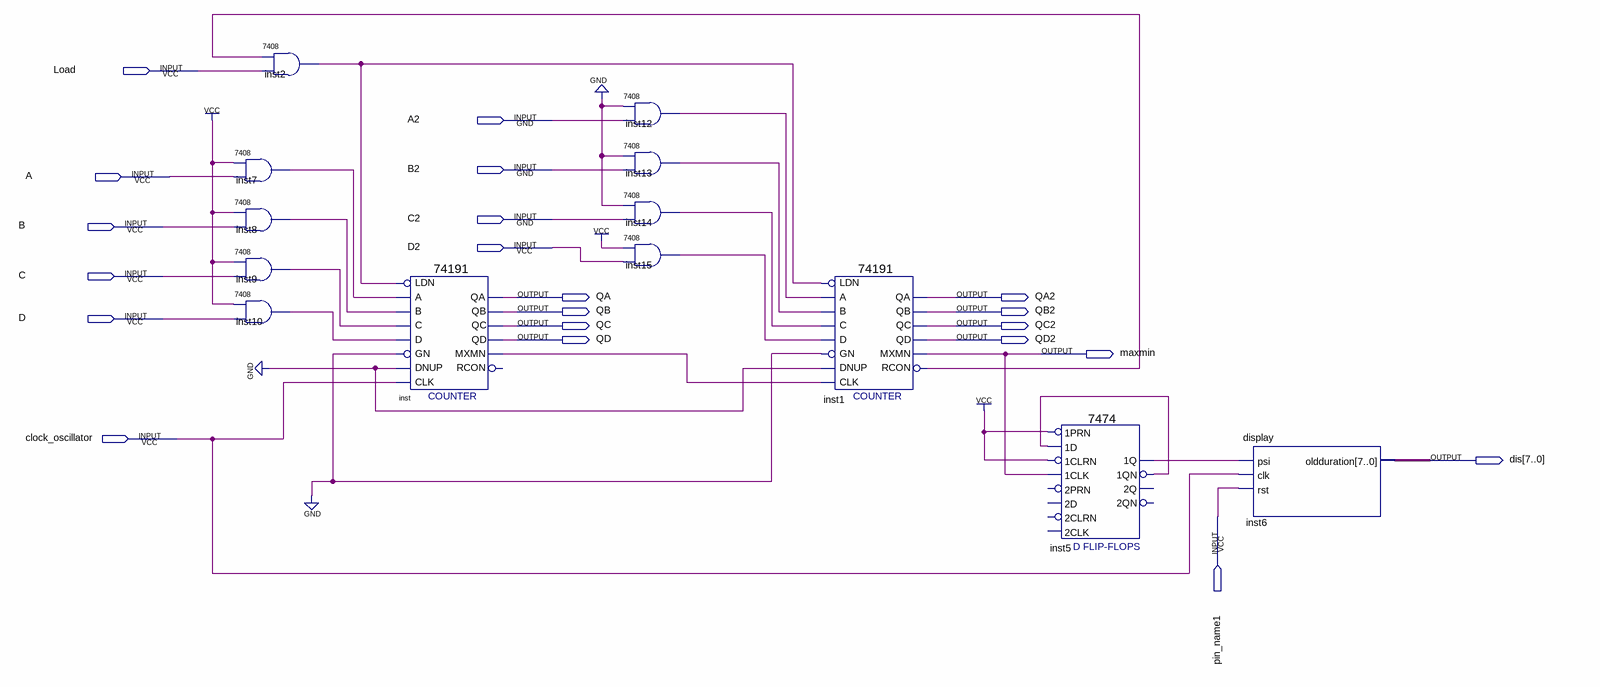
[diagram p0: schematic sheet]
// Quartus schematic F_devider_Q.bdf as structural Verilog: 13 symbols, 21 pins
module F_devider_Q (
  input  Load,
  input  A2,
  input  B2,
  input  A,
  input  C2,
  input  B,
  input  D2,
  input  C,
  input  D,
  input  clock_oscillator,
  input  pin_name1,
  output QA,
  output QA2,
  output QB,
  output QB2,
  output QC,
  output QC2,
  output QD,
  output QD2,
  output maxmin,
  output [7:0] dis
);

  wire inst1_rcon, inst2_1, inst5_1q, inst5_1qn, inst7_1, inst8_1, inst9_1, inst10_1, inst12_1, inst13_1,
       inst14_1, inst15_1, inst_mxmn;

  \7408  inst7 (.\3 (A), .\2 (1'b1), .\1 (inst7_1));
  \7408  inst8 (.\3 (B), .\2 (1'b1), .\1 (inst8_1));
  \7408  inst9 (.\3 (C), .\2 (1'b1), .\1 (inst9_1));
  \7408  inst10 (.\3 (D), .\2 (1'b1), .\1 (inst10_1));
  \7408  inst2 (.\3 (Load), .\2 (inst1_rcon), .\1 (inst2_1));
  \74191  inst (
    .LDN(inst2_1), .D(inst10_1), .C(inst9_1), .B(inst8_1), .A(inst7_1), .CLK(clock_oscillator), .DNUP(1'b0),
    .GN(1'b0), .MXMN(inst_mxmn), .QA(QA), .QB(QB), .QD(QD), .QC(QC));  // open: RCON
  \7408  inst12 (.\3 (A2), .\2 (1'b0), .\1 (inst12_1));
  \7408  inst13 (.\3 (B2), .\2 (1'b0), .\1 (inst13_1));
  \7408  inst14 (.\3 (C2), .\2 (1'b0), .\1 (inst14_1));
  \7408  inst15 (.\3 (D2), .\2 (1'b1), .\1 (inst15_1));
  \74191  inst1 (
    .LDN(inst2_1), .D(inst15_1), .C(inst14_1), .B(inst13_1), .A(inst12_1), .CLK(inst_mxmn), .DNUP(1'b0),
    .GN(1'b0), .RCON(inst1_rcon), .MXMN(maxmin), .QA(QA2), .QB(QB2), .QD(QD2), .QC(QC2));
  \7474  inst5 (
    .\1CLK (maxmin), .\1D (inst5_1qn), .\1PRN (1'b1), .\1CLRN (1'b1), .\1QN (inst5_1qn), .\1Q (inst5_1q));  // open: 2D, 2PRN, 2CLK, 2CLRN, 2Q, 2QN
  display inst6 (.psi(inst5_1q), .clk(clock_oscillator), .rst(pin_name1), .oldduration(dis));
endmodule
